# Altium schematic sheet [03].HMS.Input.SchDoc
size A4; SheetNumber: 4; SheetTotal: 7
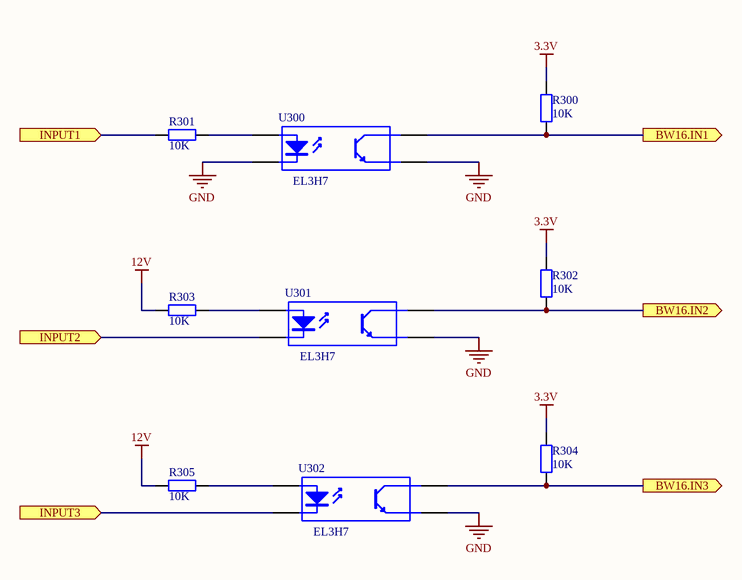
[diagram p0: [03].HMS.Input.SchDoc]

## Parts
R300  10K  [RES_0402(1005)]
R301  10K  [RES_0402(1005)]
R302  10K  [RES_0402(1005)]
R303  10K  [RES_0402(1005)]
R304  10K  [RES_0402(1005)]
R305  10K  [RES_0402(1005)]
U300  EL3H7  [Opto small]
U301  EL3H7  [Opto small]
U302  EL3H7  [Opto small]

## Ports
BW16.IN1 (out), BW16.IN2 (out), BW16.IN3 (out), INPUT1 (in), INPUT2 (in), INPUT3 (in)

## Nets
3.3V: R300.2 R302.2 R304.2
12V: R303.1 R305.1
GND: U300.2 U300.3 U301.3 U302.3
BW16.IN1: R300.1 U300.4 ; port BW16.IN1
BW16.IN2: R302.1 U301.4 ; port BW16.IN2
BW16.IN3: R304.1 U302.4 ; port BW16.IN3
INPUT1: R301.1 ; port INPUT1
INPUT2: U301.2 ; port INPUT2
INPUT3: U302.2 ; port INPUT3
NetR301_2: R301.2 U300.1
NetR303_2: R303.2 U301.1
NetR305_2: R305.2 U302.1

## Library data of the parts
R300 R302 R304 = RC0402JR-074K7P: RES 10K OHM 5% 1/16W 0402; MFR: YAGEO; Category: Chip Resistor - Surface Mount; MPN: RC0402JR-074K7P; Value: 10K
R301 R303 R305 = RC0402JR-0710KL: RES 10K OHM 5% 1/16W 0402; MPN: RC0402JR-074K7P; MFR: YAGEO; Category: Chip Resistor - Surface Mount; Value: 10K
U300-U302 = Optocouplers: EL3H7 Optoisolator 3.75KV 1CH 4-SSOP; Manufacturer: Vishay Semiconductors; Manufacturer Part Number: VOM617A-2T; Input Type: DC; Isolation Voltage: 3750 Vrms; Output Device: NPN Phototransistor; Forward Current: 5 mA; Current Transfer Ratio: 63 % to 125 %; Maximum Collector Current: 100 mA; Maximum Collector Emitter Saturation Voltage: 0.4 V; Maximum Collector Emitter Voltage: 80 V; Maximum Fall Time: 12 us; Maximum Forward Diode Voltage: 1.6 V; Maximum Input Diode Current: 60 mA; Maximum Power Dissipation: 170 mW; Maximum Reverse Diode Voltage: 6 V; Maximum Rise Time: 7 us; Number of Channels per Chip: 1 Channel; Product Status: New Product; Value: Iin = 1A, Iout = 50mA; Supplier 1: Mouser; RoHS: RoHS Compliant; Category: Transistor Output Optocouplers; Stock 1: 2915; Pricing 1: 1=0.405, 10=0.365, 100=0.324, 250=0.297, 500=0.270, 1000=0.243, 3000=0.230, 6000=0.216, 12000=0.203 (AUD); Package / Case: SOP-4 Mini-Flat; Packaging: Reel; Maximum Operating Temperature: + 110 C; Minimum Operating Temperature: - 55 C; Product Category: Optocouplers; RoHS - Mouser: Y; Minimum Order Quantity: 1; Reeling: True; ComponentLink1URL: http://www.mouser.com/ds/2/427/vom617a-223478.pdf; ComponentLink1Description: http://www.mouser.com/ds/2/427/vom617a-223478.pdf; Supplier Part Number 1: 78-VOM617A-2T; MPN: EL3H7; MFR: Vishay Semiconductors